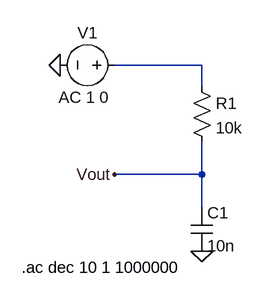
[diagram p0: schematic rc_low_pass.asc]
rc_low_pass.asc, the LTspice schematic file:
Version 4
SHEET 1 880 680
WIRE 272 16 144 16
WIRE 272 48 272 16
WIRE 272 176 272 128
WIRE 272 176 144 176
WIRE 272 224 272 176
FLAG 144 176 Vout
FLAG 272 288 0
FLAG 64 16 0
SYMBOL cap 256 224 R0
SYMATTR InstName C1
SYMATTR Value 10n
SYMBOL res 256 32 R0
SYMATTR InstName R1
SYMATTR Value 10k
SYMBOL voltage 160 16 R90
WINDOW 0 -32 56 VBottom 2
WINDOW 3 32 56 VTop 2
WINDOW 123 63 61 VBottom 2
WINDOW 39 0 0 Left 0
SYMATTR InstName V1
SYMATTR Value ""
SYMATTR Value2 AC 1 0
TEXT 8 312 Left 2 !.ac dec 10 1 1000000

The netlist it stands for:
* rc_low_pass.asc
C1 Vout 0 10n
R1 N001 Vout 10k
V1 N001 0 AC 1 0
.ac dec 10 1 1000000
.backanno
.end

* Results of the author's LTspice run, read from the files saved beside the schematic
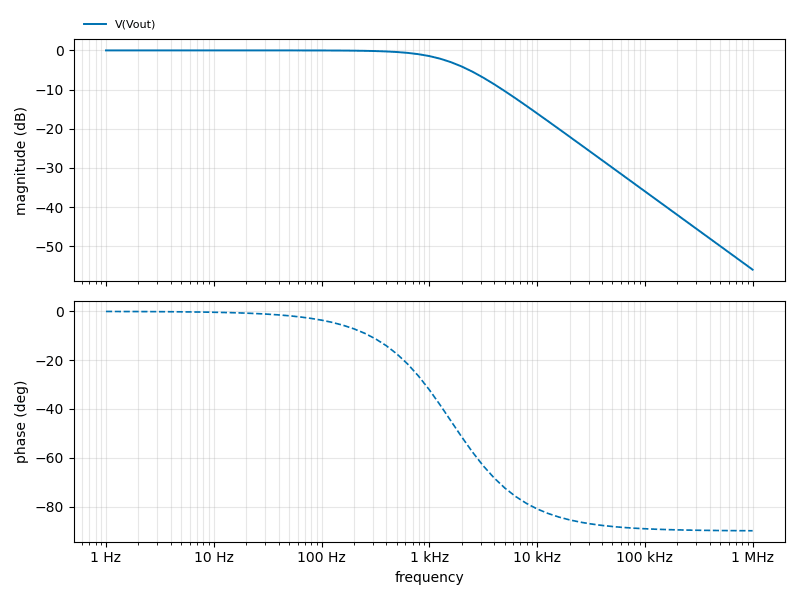
[diagram p1: AC Analysis of rc_low_pass.asc, plotted from the saved traces]
* AC Analysis, 1 run:
*   V(Vout): -0.00 dB at 1 Hz, -55.96 dB at 1 MHz, peak -0.00 dB at 1 Hz, 3 dB below the peak at 1.591 kHz